# Altium project Gateway.PRJPCB
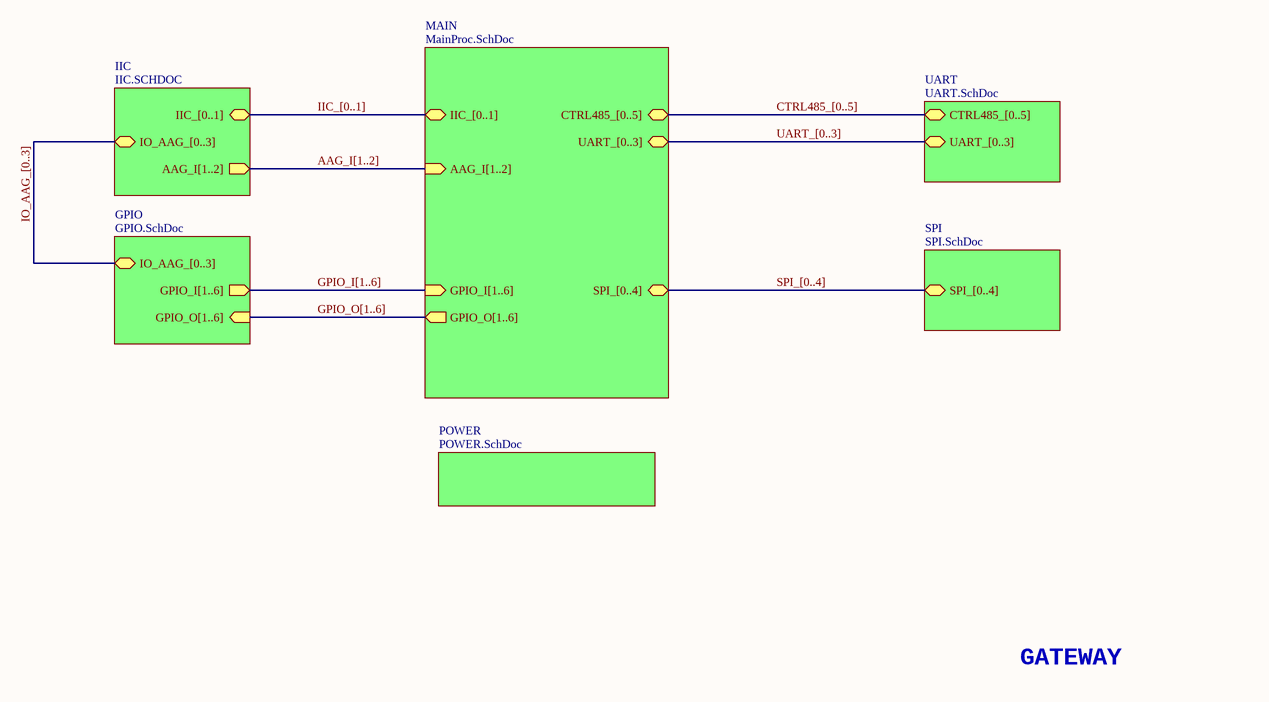
[diagram p0: Gateway.SCHDOC]
7 sheets, 140 parts. Net scope: hierarchical (ports join the sheet entries above them; power ports are global).
Board file: Gateway.PcbDoc
Sheets:
  Gateway.SCHDOC
    MAIN = MainProc.SCHDOC
    SPI = SPI.SCHDOC
    UART = UART.SCHDOC
    POWER = Power.SCHDOC
    GPIO = GPIO.SchDoc
    IIC = IIC.SchDoc

## Sheet Gateway.SCHDOC
size A4; SheetNumber: 1

### Sub-sheets
GPIO = GPIO.SchDoc: GPIO_O[1..6] (in), GPIO_I[1..6] (out), IO_AAG_[0..3] (bidir)
IIC = IIC.SCHDOC: IIC_[0..1] (bidir), IO_AAG_[0..3] (bidir), AAG_I[1..2] (out)
MAIN = MainProc.SchDoc: SPI_[0..4] (bidir), UART_[0..3] (bidir), CTRL485_[0..5] (bidir), GPIO_I[1..6] (in), GPIO_O[1..6] (out), IIC_[0..1] (bidir), AAG_I[1..2] (in)
POWER = POWER.SchDoc: no entries
SPI = SPI.SchDoc: SPI_[0..4] (bidir)
UART = UART.SchDoc: UART_[0..3] (bidir), CTRL485_[0..5] (bidir)

### Buses and harness runs
bus AAG_I[1..2] = sheet IIC/AAG_I[1..2] = sheet MAIN/AAG_I[1..2]
bus CTRL485_[0..5] = sheet MAIN/CTRL485_[0..5] = sheet UART/CTRL485_[0..5]
bus GPIO_I[1..6] = sheet GPIO/GPIO_I[1..6] = sheet MAIN/GPIO_I[1..6]
bus GPIO_O[1..6] = sheet GPIO/GPIO_O[1..6] = sheet MAIN/GPIO_O[1..6]
bus IIC_[0..1] = sheet IIC/IIC_[0..1] = sheet MAIN/IIC_[0..1]
bus IO_AAG_[0..3] = sheet GPIO/IO_AAG_[0..3] = sheet IIC/IO_AAG_[0..3]
bus SPI_[0..4] = sheet MAIN/SPI_[0..4] = sheet SPI/SPI_[0..4]
bus UART_[0..3] = sheet MAIN/UART_[0..3] = sheet UART/UART_[0..3]

### Notes on the sheet
- GATEWAY

## Sheet MainProc.SCHDOC
size B; SheetNumber: 2
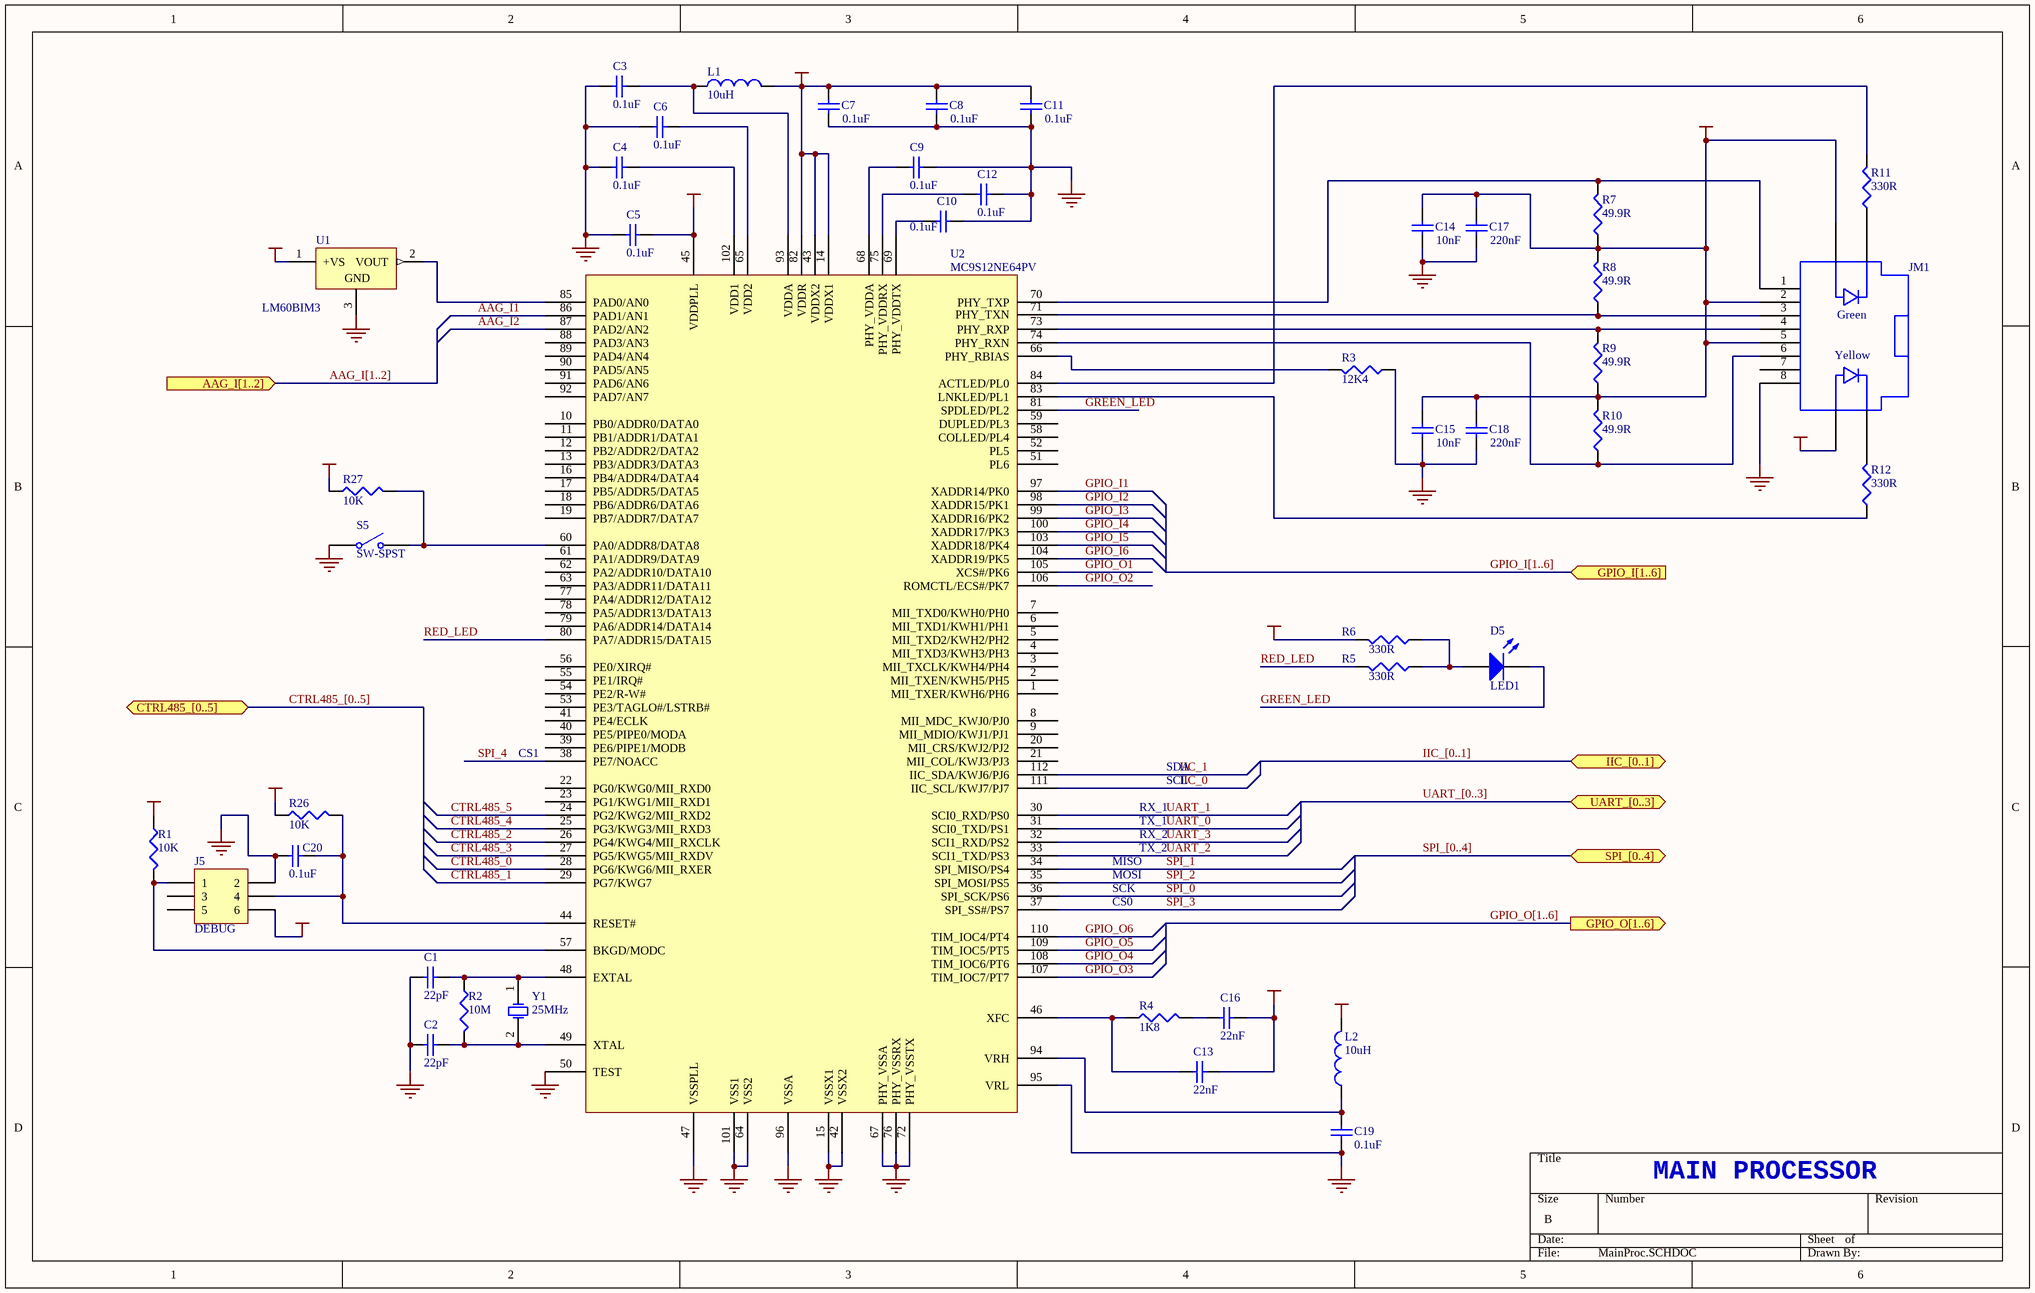
[diagram p1: MainProc.SCHDOC]

### Parts
C1  value 22pF  [_1206]  (hidden comment: Cap Semi)
C2  value 22pF  [_1206]  (hidden comment: Cap Semi)
C3  value 0.1uF  [_0805]  (hidden comment: Cap Semi)
C4  value 0.1uF  [_0805]  (hidden comment: Cap Semi)
C5  value 0.1uF  [_0805]  (hidden comment: Cap Semi)
C6  value 0.1uF  [_0805]  (hidden comment: Cap Semi)
C7  value 0.1uF  [_0805]  (hidden comment: Cap Semi)
C8  value 0.1uF  [_0805]  (hidden comment: Cap Semi)
C9  value 0.1uF  [_0805]  (hidden comment: Cap Semi)
C10  value 0.1uF  [_0805]  (hidden comment: Cap Semi)
C11  value 0.1uF  [_0805]  (hidden comment: Cap Semi)
C12  value 0.1uF  [_0805]  (hidden comment: Cap Semi)
C13  value 22nF  [_0805]  (hidden comment: Cap Semi)
C14  value 10nF  [_0805]  (hidden comment: Cap Semi)
C15  value 10nF  [_0805]  (hidden comment: Cap Semi)
C16  value 22nF  [_0805]  (hidden comment: Cap Semi)
C17  value 220nF  [_0805]  (hidden comment: Cap Semi)
C18  value 220nF  [_0805]  (hidden comment: Cap Semi)
C19  value 0.1uF  [_0805]  (hidden comment: Cap Semi)
C20  value 0.1uF  [_0805]  (hidden comment: Cap Semi)
D5  LED1  [LED_PCB]
J5  DEBUG  [HDR2X3]
JM1  JACK_RJ45_LED  [JACK_RJ45_LEDS]  (value not drawn)
L1  value 10uH  [_0805]  (hidden comment: Inductor)
L2  value 10uH  [_0805]  (hidden comment: Inductor)
R1  value 10K  [_0805]  (hidden comment: Res3)
R2  value 10M  [_1206]  (hidden comment: Res3)
R3  value 12K4  [_0805]  (hidden comment: Res3)
R4  value 1K8  [_0805]  (hidden comment: Res3)
R5  value 330R  [_0805]  (hidden comment: Res3)
R6  value 330R  [_0805]  (hidden comment: Res3)
R7  value 49.9R  [_0805]  (hidden comment: Res3)
R8  value 49.9R  [_0805]  (hidden comment: Res3)
R9  value 49.9R  [_0805]  (hidden comment: Res3)
R10  value 49.9R  [_0805]  (hidden comment: Res3)
R11  value 330R  [_0805]  (hidden comment: Res3)
R12  value 330R  [_0805]  (hidden comment: Res3)
R26  value 10K  [_0805]  (hidden comment: Res3)
R27  value 10K  [_0805]  (hidden comment: Res3)
S5  SW-SPST  [SWITCH]
U1  LM60BIM3  [MA03B]
U2  MC9S12NE64PV  [QFP20x20-G112/Y1.6N]
Y1  value 25MHz  [HC49/4H_SMX]  (hidden comment: XTAL)

### Ports
AAG_I[1..2] (in), CTRL485_[0..5] (bidir), GPIO_I[1..6] (in), GPIO_O[1..6] (out), IIC_[0..1] (bidir), SPI_[0..4] (bidir), UART_[0..3] (bidir)

### Nets
GND: C1.2 C2.2 C3.1 C4.2 C5.2 C6.2 C7.1 C8.1 C9.1 C10.1 C11.1 C12.1 C14.1 C15.1 C17.1 C18.1 C19.1 C20.1 J5.2 JM1.8 R3.1 S5.1(COMMON) U1.3(GND) U2.15(VSSX1) U2.42(VSSX2) U2.47(VSSPLL) U2.50(TEST) U2.64(VSS2) U2.67(PHY_VSSA) U2.72(PHY_VSSTX) U2.76(PHY_VSSRX) U2.95(VRL) U2.96(VSSA) U2.101(VSS1)
VCC_3V: C7.2 C8.2 C11.2 C14.2 C15.2 C17.2 C18.2 J5.6 JM1.2 JM1.5 JM1.GA JM1.YA L1.2 L2.2 R1.1 R6.2 R7.1 R8.2 R9.1 R10.2 R26.1 R27.1 U1.1(+VS) U2.14(VDDX1) U2.43(VDDX2) U2.82(VDDR)
VDD_PLL: C5.1 C13.1 C16.1 U2.45(VDDPLL)
AAG_I1: U2.86(PAD1/AN1)
AAG_I2: U2.87(PAD2/AN2)
CTRL485_0: U2.28(PG6/KWG6/MII_RXER)
CTRL485_1: U2.29(PG7/KWG7)
CTRL485_2: U2.26(PG4/KWG4/MII_RXCLK)
CTRL485_3: U2.27(PG5/KWG5/MII_RXDV)
CTRL485_4: U2.25(PG3/KWG3/MII_RXD3)
CTRL485_5: U2.24(PG2/KWG2/MII_RXD2)
GPIO_I1: U2.97(XADDR14/PK0)
GPIO_I2: U2.98(XADDR15/PK1)
GPIO_I3: U2.99(XADDR16/PK2)
GPIO_I4: U2.100(XADDR17/PK3)
GPIO_I5: U2.103(XADDR18/PK4)
GPIO_I6: U2.104(XADDR19/PK5)
GPIO_O1: U2.105(XCS#/PK6)
GPIO_O2: U2.106(ROMCTL/ECS#/PK7)
GPIO_O3: U2.107(TIM_IOC7/PT7)
GPIO_O4: U2.108(TIM_IOC6/PT6)
GPIO_O5: U2.109(TIM_IOC5/PT5)
GPIO_O6: U2.110(TIM_IOC4/PT4)
GREEN_LED: D5.2(K) U2.81(SPDLED/PL2)
IIC_0: U2.111(IIC_SCL/KWJ7/PJ7)
IIC_1: U2.112(IIC_SDA/KWJ6/PJ6)
RED_LED: R5.2 U2.80(PA7/ADDR15/DATA15)
SPI_0: U2.36(SPI_SCK/PS6)
SPI_1: U2.34(SPI_MISO/PS4)
SPI_2: U2.35(SPI_MOSI/PS5)
SPI_3: U2.37(SPI_SS#/PS7)
SPI_4: U2.38(PE7/NOACC)
UART_0: U2.31(SCI0_TXD/PS1)
UART_1: U2.30(SCI0_RXD/PS0)
UART_2: U2.33(SCI1_TXD/PS3)
UART_3: U2.32(SCI1_RXD/PS2)
NetC1_1: C1.1 R2.1 U2.48(EXTAL) Y1.1(OSC1)
NetC2_1: C2.1 R2.2 U2.49(XTAL) Y1.2(OSC2)
NetC3_2: C3.2 L1.1 U2.93(VDDA)
NetC4_1: C4.1 U2.102(VDD1)
NetC6_1: C6.1 U2.65(VDD2)
NetC9_2: C9.2 U2.68(PHY_VDDA)
NetC10_2: C10.2 U2.69(PHY_VDDTX)
NetC12_2: C12.2 U2.75(PHY_VDDRX)
NetC13_2: C13.2 R4.1 U2.46(XFC)
NetC16_2: C16.2 R4.2
NetC19_2: C19.2 L2.1 U2.94(VRH)
NetC20_2: C20.2 J5.4 R26.2 U2.44(RESET#)
NetD5_1: D5.1(A) R5.1 R6.1
NetJ5_1: J5.1 R1.2 U2.57(BKGD/MODC)
NetJM1_1: JM1.1 R7.2 U2.70(PHY_TXP)
NetJM1_3: JM1.3 R8.1 U2.71(PHY_TXN)
NetJM1_4: JM1.4 R9.2 U2.73(PHY_RXP)
NetJM1_6: JM1.6 R10.1 U2.74(PHY_RXN)
NetJM1_GK: JM1.GK R11.1
NetJM1_YK: JM1.YK R12.2
NetR3_2: R3.2 U2.66(PHY_RBIAS)
NetR11_2: R11.2 U2.84(ACTLED/PL0)
NetR12_1: R12.1 U2.83(LNKLED/PL1)
NetR27_2: R27.2 S5.2(NO) U2.60(PA0/ADDR8/DATA8)
NetU1_2: U1.2(VOUT) U2.85(PAD0/AN0)

Not connected (* = marked no-connect by the designer): J5 3 5; JM1 7; U2 1(MII_TXER/KWH6/PH6) 2(MII_TXEN/KWH5/PH5) 3(MII_TXCLK/KWH4/PH4) 4(MII_TXD3/KWH3/PH3) 5(MII_TXD2/KWH2/PH2) 6(MII_TXD1/KWH1/PH1) 7(MII_TXD0/KWH0/PH0) 8(MII_MDC_KWJ0/PJ0) 9(MII_MDIO/KWJ1/PJ1) 10(PB0/ADDR0/DATA0) 11(PB1/ADDR1/DATA1) 12(PB2/ADDR2/DATA2) 13(PB3/ADDR3/DATA3) 16(PB4/ADDR4/DATA4) 17(PB5/ADDR5/DATA5) 18(PB6/ADDR6/DATA6) 19(PB7/ADDR7/DATA7) 20(MII_CRS/KWJ2/PJ2) 21(MII_COL/KWJ3/PJ3) 22(PG0/KWG0/MII_RXD0) 23(PG1/KWG1/MII_RXD1) 39(PE6/PIPE1/MODB) 40(PE5/PIPE0/MODA) 41(PE4/ECLK) 51(PL6) 52(PL5) 53(PE3/TAGLO#/LSTRB#) 54(PE2/R-W#) 55(PE1/IRQ#) 56(PE0/XIRQ#) 58(COLLED/PL4) 59(DUPLED/PL3) 61(PA1/ADDR9/DATA9) 62(PA2/ADDR10/DATA10) 63(PA3/ADDR11/DATA11) 77(PA4/ADDR12/DATA12) 78(PA5/ADDR13/DATA13) 79(PA6/ADDR14/DATA14) 88(PAD3/AN3) 89(PAD4/AN4) 90(PAD5/AN5) 91(PAD6/AN6) 92(PAD7/AN7)

### Buses and harness runs
bus AAG_I[1..2] = port AAG_I[1..2]
bus CTRL485_[0..5] = port CTRL485_[0..5]
bus GPIO_I[1..6] = port GPIO_I[1..6]
bus GPIO_O[1..6] = port GPIO_O[1..6]
bus IIC_[0..1] = port IIC_[0..1]
bus SPI_[0..4] = port SPI_[0..4]
bus UART_[0..3] = port UART_[0..3]

### Notes on the sheet
- (near U2) CS1
- SDA
- RX_2
- TX_1
- RX_1
- SCL
- SCK
- MISO
- MOSI
- CS0
- TX_2
- MAIN PROCESSOR
- (in symbol JACK_RJ45_LED) Green; Yellow

### Library data of the parts
C1-C20 = Cap Semi: Capacitor (Semiconductor SIM Model); Published: 8-Jun-2000; Revision: July-2002: Re-released for DXP Platform.; Publisher: Altium Limited
D5 = LED1: Typical RED GaAs LED; Published: 8-Jun-2000; Revision: July-2002: Re-released for DXP Platform.; Publisher: Altium Limited
J5 = Header 3X2: Header, 3-Pin, Dual row; Revision: 17-Jul-2002: Re-released for DXP Platform.; Publisher: Altium Limited
JM1 = JACK_RJ45_LED: RJ45 Connector Jack with Leds
R1-R12 R26 R27 = Res3: Resistor; Published: 8-Jun-2000; Revision: July-2002: Re-released for DXP Platform.; Publisher: Altium Limited
S5 = SW-SPST: Single-Pole, Single-Throw Switch; Published: 24-Mar-1999; Revision: July-2002: Re-released for DXP Platform.; Publisher: Altium Limited
U1 = LM60BIM3: 2.7V, SOT-23 Temperature Sensor; Package Information: Latest Revision: 2000; Published: 15-Apr-2002; Datasheet: Latest Revision: May-1998; Package Reference: MA03B; Publisher: Altium Limited
U2 = MC9S12NE64PV: Integrated Ethernet Controller
Y1 = XTAL: Crystal Oscillator; Published: 8-Jun-2000; Revision: July-2002: Re-released for DXP Platform.; Publisher: Altium Limited
L1 L2 = Inductor: Published: 8-Jun-2000; Revision: July-2002: Re-released for DXP Platform.; Publisher: Altium Limited

## Sheet SPI.SCHDOC
size A4; SheetNumber: 6
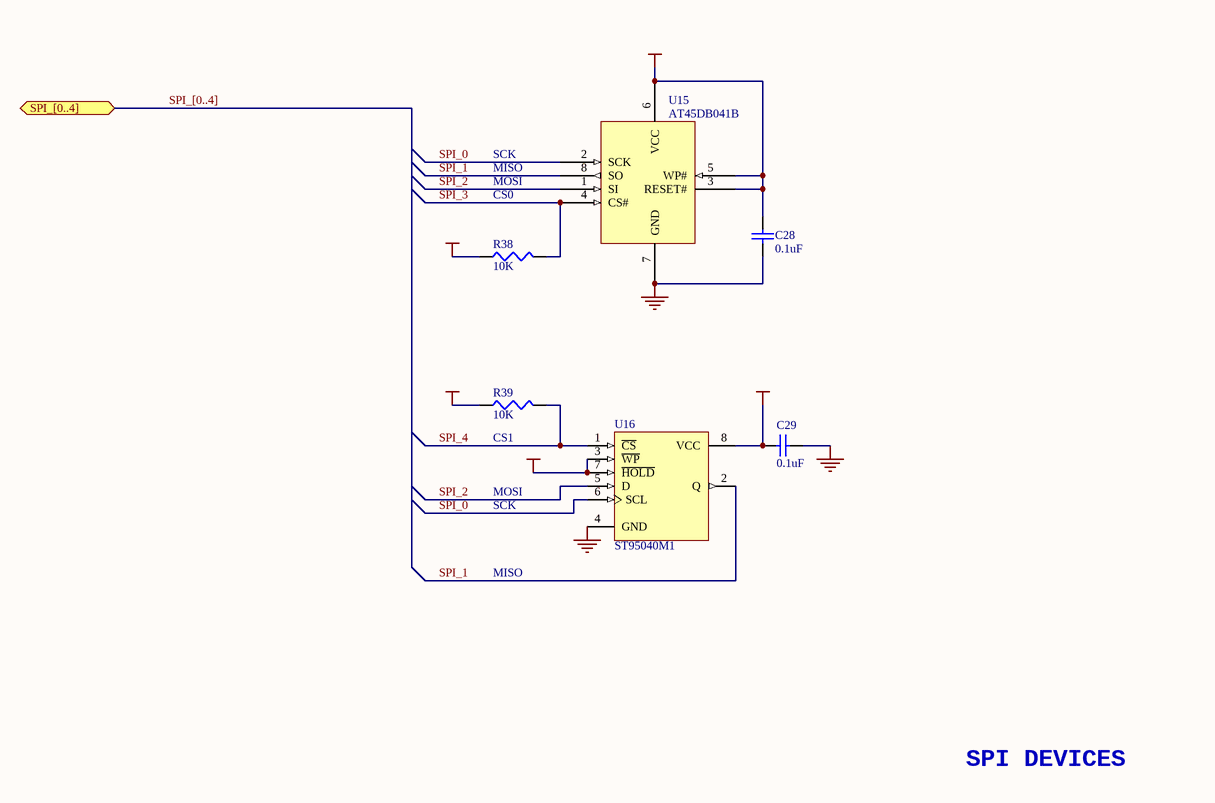
[diagram p2: SPI.SCHDOC]

### Parts
C28  value 0.1uF  [_0805]  (hidden comment: Cap Semi)
C29  value 0.1uF  [_0805]  (hidden comment: Cap Semi)
R38  value 10K  [_0805]  (hidden comment: Res3)
R39  value 10K  [_0805]  (hidden comment: Res3)
U15  AT45DB041B  [SO-G8/E4.1]
U16  ST95040M1  [SOP8]

### Ports
SPI_[0..4] (bidir)

### Nets
GND: C28.2 C29.2 U15.7(GND) U16.4(GND)
VCC_3V: C28.1 C29.1 R38.1 R39.1 U15.3(RESET#) U15.5(WP#) U15.6(VCC) U16.3(~{WP}) U16.7(~{HOLD}) U16.8(VCC)
SPI_0: U15.2(SCK) U16.6(SCL)
SPI_1: U15.8(SO) U16.2(Q)
SPI_2: U15.1(SI) U16.5(D)
SPI_3: R38.2 U15.4(CS#)
SPI_4: R39.2 U16.1(~{CS})

### Buses and harness runs
bus SPI_[0..4] = port SPI_[0..4]

### Notes on the sheet
- SCK
- MISO
- MOSI
- CS0
- (near R39) CS1
- SPI DEVICES

### Library data of the parts
C28 C29 = Cap Semi: Capacitor (Semiconductor SIM Model); Published: 8-Jun-2000; Revision: July-2002: Re-released for DXP Platform.; Publisher: Altium Limited
R38 R39 = Res3: Resistor; Published: 8-Jun-2000; Revision: July-2002: Re-released for DXP Platform.; Publisher: Altium Limited
U15 = AT45DB041B: 4 Megabit DataFlash Memory
U16 = ST95040M1: 4K Serial SPI EEPROM with Positive Clock Strobe; Package Information: Latest Revision: Jul-1999; Published: 24-Aug-2001; Revision: 17-Jul-2002: Re-released for DXP Platform.; Datasheet: Latest Revision: Jun-1998; Package Reference: SOP8; Publisher: Altium Limited

## Sheet UART.SCHDOC
size A4; SheetNumber: 4
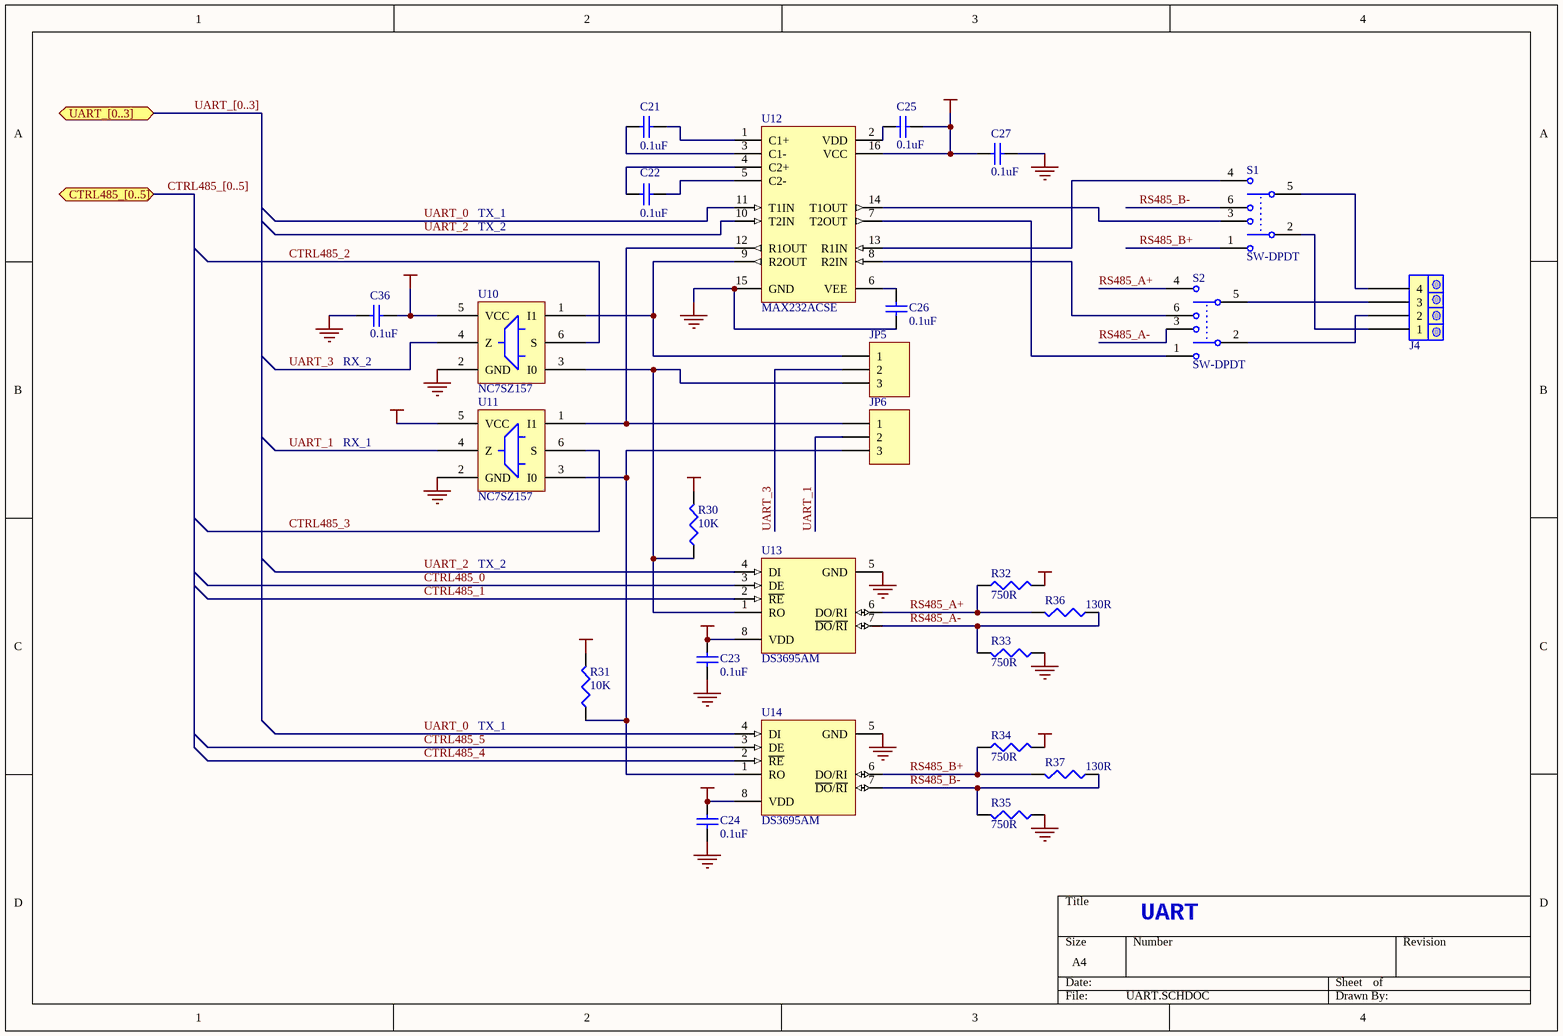
[diagram p3: UART.SCHDOC]

### Parts
C21  value 0.1uF  [_0805]  (hidden comment: Cap Semi)
C22  value 0.1uF  [_0805]  (hidden comment: Cap Semi)
C23  value 0.1uF  [_0805]  (hidden comment: Cap Semi)
C24  value 0.1uF  [_0805]  (hidden comment: Cap Semi)
C25  value 0.1uF  [_0805]  (hidden comment: Cap Semi)
C26  value 0.1uF  [_0805]  (hidden comment: Cap Semi)
C27  value 0.1uF  [_0805]  (hidden comment: Cap Semi)
C36  value 0.1uF  [_0805]  (hidden comment: Cap Semi)
J4  BORNERA_X4  [BORNERA_X4]  (value not drawn)
JP5  Header 3  [HDR1X3]  (value not drawn)
JP6  Header 3  [HDR1X3]  (value not drawn)
R30  value 10K  [_0805]  (hidden comment: Res3)
R31  value 10K  [_0805]  (hidden comment: Res3)
R32  value 750R  [_1206]  (hidden comment: Res3)
R33  value 750R  [_1206]  (hidden comment: Res3)
R34  value 750R  [_1206]  (hidden comment: Res3)
R35  value 750R  [_1206]  (hidden comment: Res3)
R36  value 130R  [_1206]  (hidden comment: Res3)
R37  value 130R  [_1206]  (hidden comment: Res3)
S1  SW-DPDT  [Switch_EG2207]
S2  SW-DPDT  [Switch_EG2207]
U10  NC7SZ157  [SO-G6/Z2.8]
U11  NC7SZ157  [SO-G6/Z2.8]
U12  MAX232ACSE  [NSO16]
U13  DS3695AM  [M08A]
U14  DS3695AM  [M08A]

### Ports
CTRL485_[0..5] (bidir), UART_[0..3] (bidir)

### Nets
GND: C23.2 C24.2 C26.2 C27.2 C36.1 R33.1 R35.1 U10.2(GND) U11.2(GND) U12.15(GND) U13.5(GND) U14.5(GND)
VCC_3V: C36.2 U10.5(VCC) U11.5(VCC)
VCC_5V: C23.1 C24.1 C25.1 C27.1 R30.2 R31.2 R32.2 R34.2 U12.16(VCC) U13.8(VDD) U14.8(VDD)
CTRL485_0: U13.3(DE)
CTRL485_1: U13.2(~{RE})
CTRL485_2: U10.6(S)
CTRL485_3: U11.6(S)
CTRL485_4: U14.2(~{RE})
CTRL485_5: U14.3(DE)
RS485_A+: R32.1 R36.2 S2.4 U13.6(DO/RI)
RS485_A-: R33.2 R36.1 S2.3 U13.7(~{DO}/~{RI})
RS485_B+: R34.1 R37.2 S1.1 U14.6(DO/RI)
RS485_B-: R35.2 R37.1 S1.6 U14.7(~{DO}/~{RI})
UART_0: U12.11(T1IN) U14.4(DI)
UART_1: JP6.2 U11.4(Z)
UART_2: U12.10(T2IN) U13.4(DI)
UART_3: JP5.2 U10.4(Z)
NetC21_1: C21.1 U12.3(C1-)
NetC21_2: C21.2 U12.1(C1+)
NetC22_1: C22.1 U12.4(C2+)
NetC22_2: C22.2 U12.5(C2-)
NetC25_2: C25.2 U12.2(VDD)
NetC26_1: C26.1 U12.6(VEE)
NetJ4_1: J4.1 S1.2
NetJ4_2: J4.2 S2.2
NetJ4_3: J4.3 S2.5
NetJ4_4: J4.4 S1.5
NetJP5_1: JP5.1 U10.1(I1) U12.9(R2OUT)
NetJP5_3: JP5.3 R30.1 U10.3(I0) U13.1(RO)
NetJP6_1: JP6.1 U11.1(I1) U12.12(R1OUT)
NetJP6_3: JP6.3 R31.1 U11.3(I0) U14.1(RO)
NetS1_3: S1.3 U12.14(T1OUT)
NetS1_4: S1.4 U12.13(R1IN)
NetS2_1: S2.1 U12.7(T2OUT)
NetS2_6: S2.6 U12.8(R2IN)

### Buses and harness runs
bus CTRL485_[0..5] = port CTRL485_[0..5]
bus UART_[0..3] = port UART_[0..3]

### Notes on the sheet
- TX_1
- TX_2
- (near C36) RX_2
- RX_1
- UART

### Library data of the parts
C21-C27 C36 = Cap Semi: Capacitor (Semiconductor SIM Model); Published: 8-Jun-2000; Revision: July-2002: Re-released for DXP Platform.; Publisher: Altium Limited
JP5 JP6 = Header 3: Header, 3-Pin; Revision: 17-Jul-2002: Re-released for DXP Platform.; Publisher: Altium Limited
R30-R37 = Res3: Resistor; Published: 8-Jun-2000; Revision: July-2002: Re-released for DXP Platform.; Publisher: Altium Limited
S1 S2 = SW-DPDT: Double-Pole, Double-Throw Switch; Published: 24-Mar-1999; Revision: July-2002: Re-released for DXP Platform.; Publisher: Altium Limited
U10 U11 = NC7SZ157: Tiny Logic 2-Input Non-Inverter Mux
U12 = MAX232ACSE: +5V Powered, Multi-Channel RS-232 Driver/Receiver; Code - JEDEC: MS-012-AC; Code - IPC: SO16; Published: 16-Jan-2001; Revision: 17-Jul-2002: Re-released for DXP Platform.; Package Reference: NSO16; Publisher: Altium Limited
U13 U14 = DS3695AM: Multipoint RS485/RS422 Transceiver; Package Information: Latest Revision: Sep-1997; Code - JEDEC: MS-012-AA; Code - IPC: SO8; Published: 15-Apr-2002; Datasheet: Latest Revision: Feb-1996; Package Reference: M08A; Publisher: Altium Limited

## Sheet Power.SCHDOC
size A4; SheetNumber: 3
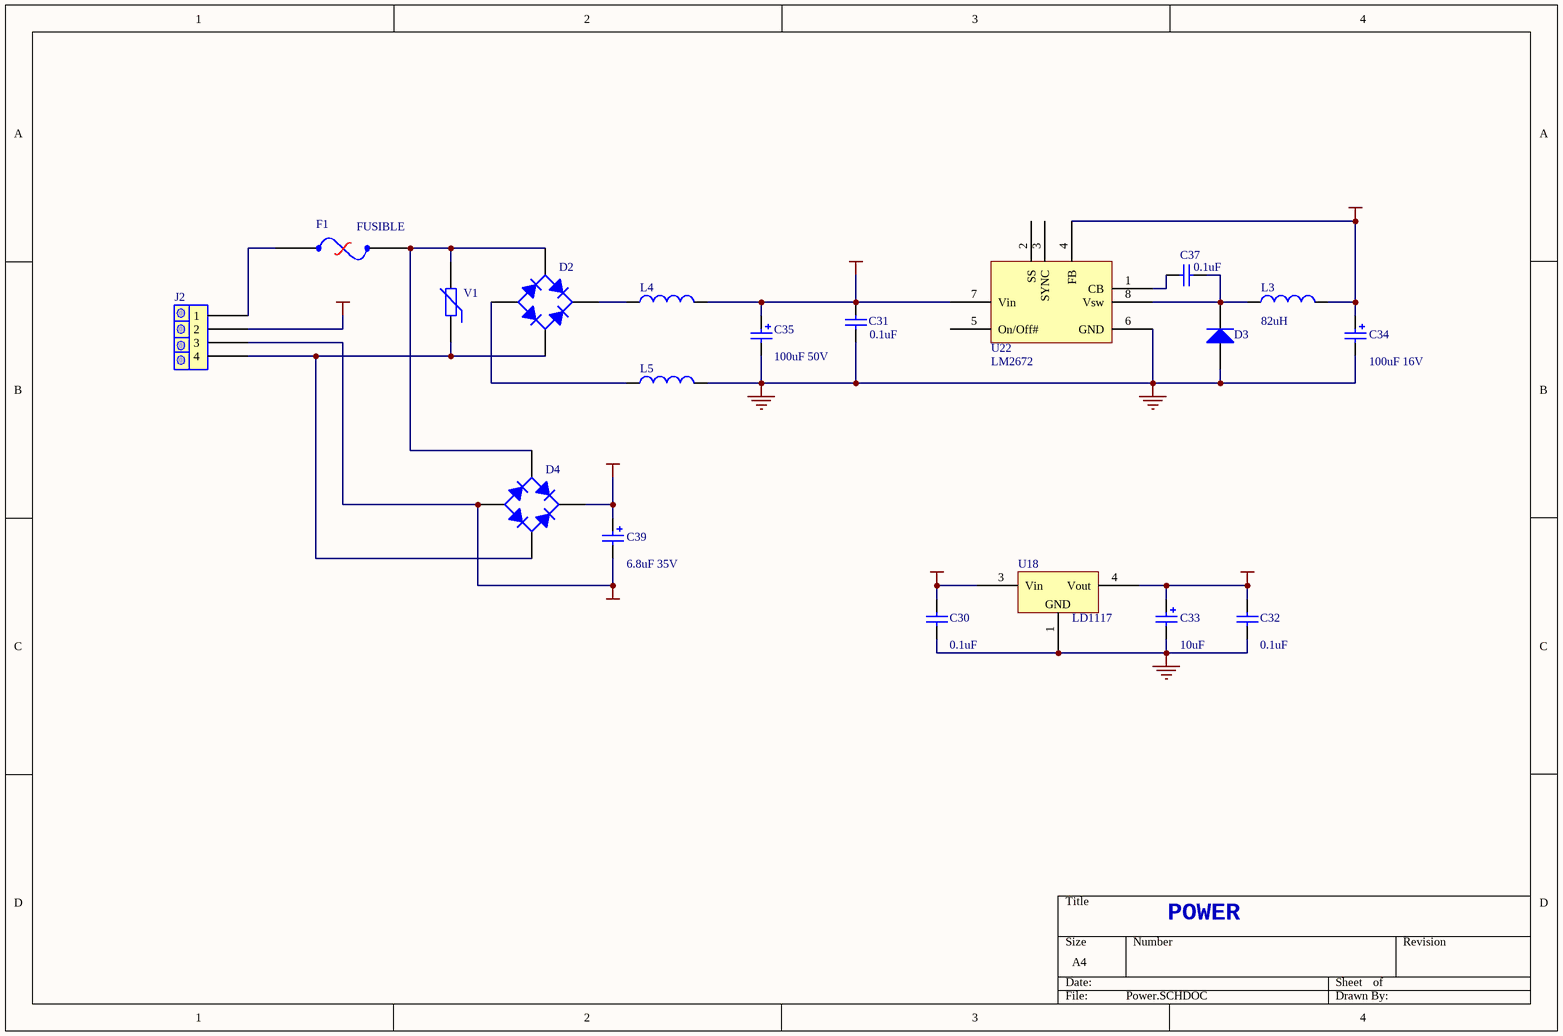
[diagram p4: Power.SCHDOC]

### Parts
C30  value 0.1uF  [_0805]  (hidden comment: Cap Semi)
C31  value 0.1uF  [_0805]  (hidden comment: Cap Semi)
C32  value 0.1uF  [_0805]  (hidden comment: Cap Semi)
C33  value 10uF  [TC3528-1411]  (hidden comment: Cap Pol3)
C34  value 100uF 16V  [TC7360-2924]  (hidden comment: Cap Pol3)
C35  value 100uF 50V  [CAPPR3.5-8X11.5]  (hidden comment: Cap Pol1)
C37  value 0.1uF  [_0805]  (hidden comment: Cap Semi)
C39  value 6.8uF 35V  [TC6032-2412]  (hidden comment: Cap Pol3)
D2  Bridge1  [BRIDGE_2A]  (value not drawn)
D3  Diode  [SMA]  (value not drawn)
D4  Bridge1  [BRIDGE_2A]  (value not drawn)
F1  FUSIBLE  [FUSE]
J2  BORNERA_X4  [BORNERA_X4]  (value not drawn)
L3  value 82uH  [POWER_IND]  (hidden comment: Inductor)
L4  Inductor  [CR3225-1210]  (value not drawn)
L5  Inductor  [CR3225-1210]  (value not drawn)
U18  LD1117  [SIP-G3/D11.3]
U22  LM2672  [SO-G8/D5]
V1  Res Varistor  [CR3216-1206]  (value not drawn)

### Nets
GND: C30.1 C31.1 C32.1 C33.2 C34.2 C35.2 D3.1(A) L5.2 U18.1(GND) U22.6(GND)
GND_PWR: C39.2 D4.1(A) J2.3
VCC_3V: C32.2 C33.1 U18.4(Vout)
VCC_5V: C30.2 C34.1 L3.2 U18.3(Vin) U22.4(FB)
VCC_IN: C31.2 C35.1 L4.2 U22.7(Vin)
VCC_PWR: C39.1 D4.3(K) J2.2
NetC37_1: C37.1 D3.2(K) L3.1 U22.8(Vsw)
NetC37_2: C37.2 U22.1(CB)
NetD2_1: D2.1(A) L5.1
NetD2_2: D2.2(C) D4.2(C) F1.2 V1.2
NetD2_3: D2.3(K) L4.1
NetD2_4: D2.4(C) D4.4(C) J2.4 V1.1
NetF1_1: F1.1 J2.1

Not connected (* = marked no-connect by the designer): U22 2(SS) 3(SYNC) 5(On/Off#)

### Notes on the sheet
- POWER

### Library data of the parts
C30-C32 C37 = Cap Semi: Capacitor (Semiconductor SIM Model); Published: 8-Jun-2000; Revision: July-2002: Re-released for DXP Platform.; Publisher: Altium Limited
C33 C34 C39 = Cap Pol3: Polarized Capacitor (Surface Mount); Published: 8-Jun-2000; Revision: July-2002: Re-released for DXP Platform.; Publisher: Altium Limited
C35 = Cap Pol1: Polarized Capacitor (Radial); Published: 8-Jun-2000; Revision: July-2002: Re-released for DXP Platform.; Publisher: Altium Limited
D2 D4 = Bridge1: Full Wave Diode Bridge; Published: 8-Jun-2000; Revision: July-2002: Re-released for DXP Platform.; Publisher: Altium Limited
D3 = Diode: Default Diode; Code - JEDEC: DO-214-AB; Published: 8-Jun-2000; Revision: July-2002: Re-released for DXP Platform.; Publisher: Altium Limited
F1 = FUSIBLE: Resetteable Fuse
L4 L5 = Inductor: Value: 10mH; Published: 8-Jun-2000; Revision: July-2002: Re-released for DXP Platform.; Publisher: Altium Limited
U18 = VREG_3V3_DPAK: SMD DPAK Voltage Regulator
U22 = LM2672: Simple switcher voltage regulator 1A
V1 = Res Varistor: Varistor (Voltage-Sensitive Resistor); Published: 24-Mar-1999; Revision: July-2002: Re-released for DXP Platform.; Publisher: Altium Limited
L3 = Inductor: Published: 8-Jun-2000; Revision: July-2002: Re-released for DXP Platform.; Publisher: Altium Limited

## Sheet GPIO.SchDoc
size A4; SheetNumber: 5
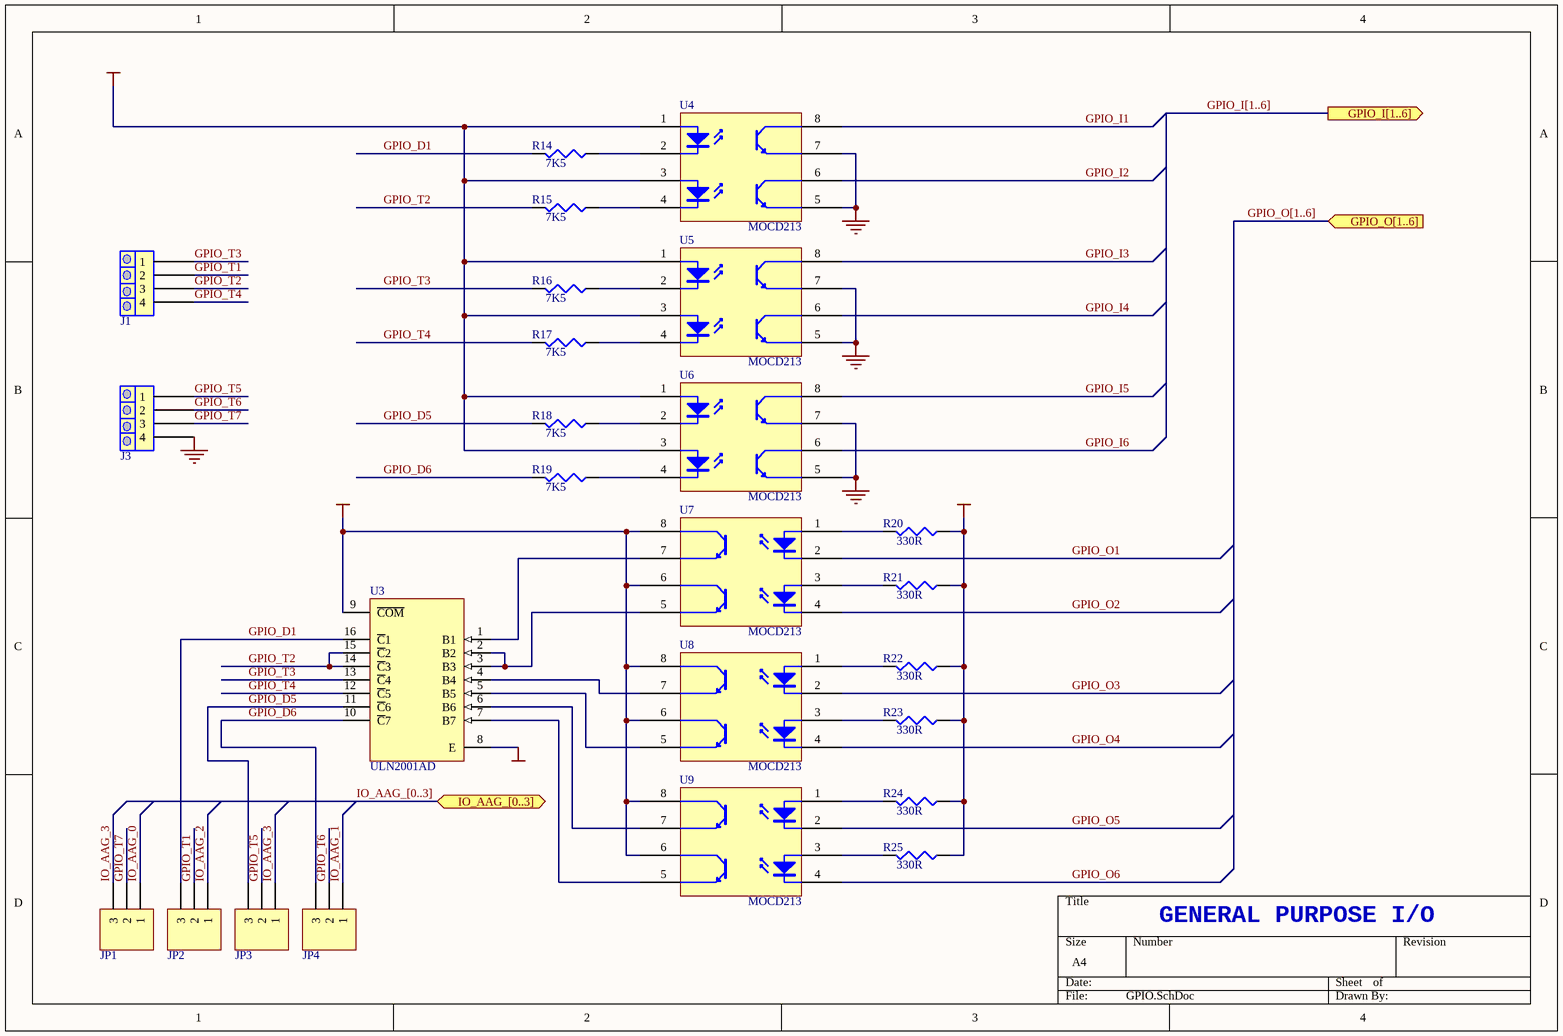
[diagram p5: GPIO.SchDoc]

### Parts
J1  BORNERA_X4  [BORNERA_X4]  (value not drawn)
J3  BORNERA_X4  [BORNERA_X4]  (value not drawn)
JP1  Header 3  [HDR1X3]  (value not drawn)
JP2  Header 3  [HDR1X3]  (value not drawn)
JP3  Header 3  [HDR1X3]  (value not drawn)
JP4  Header 3  [HDR1X3]  (value not drawn)
R14  value 7K5  [_0805]  (hidden comment: Res3)
R15  value 7K5  [_0805]  (hidden comment: Res3)
R16  value 7K5  [_0805]  (hidden comment: Res3)
R17  value 7K5  [_0805]  (hidden comment: Res3)
R18  value 7K5  [_0805]  (hidden comment: Res3)
R19  value 7K5  [_0805]  (hidden comment: Res3)
R20  value 330R  [_0805]  (hidden comment: Res3)
R21  value 330R  [_0805]  (hidden comment: Res3)
R22  value 330R  [_0805]  (hidden comment: Res3)
R23  value 330R  [_0805]  (hidden comment: Res3)
R24  value 330R  [_0805]  (hidden comment: Res3)
R25  value 330R  [_0805]  (hidden comment: Res3)
U3  ULN2001AD  [D016]
U4  MOCD213  [SO-G8/D5]
U5  MOCD213  [SO-G8/D5]
U6  MOCD213  [SO-G8/D5]
U7  MOCD213  [SO-G8/D5]
U8  MOCD213  [SO-G8/D5]
U9  MOCD213  [SO-G8/D5]

### Ports
GPIO_I[1..6] (out), GPIO_O[1..6] (in), IO_AAG_[0..3] (bidir)

### Nets
GND: J3.4 U4.5 U4.7 U5.5 U5.7 U6.5 U6.7
GND_PWR: U3.8(E)
VCC_3V: R20.1 R21.1 R22.1 R23.1 R24.1 R25.1
VCC_PWR: U3.9(~{COM}) U4.1 U4.3 U5.1 U5.3 U6.1 U6.3 U7.6 U7.8 U8.6 U8.8 U9.6 U9.8
GPIO_D1: JP2.3 R14.2 U3.16(~{C}1)
GPIO_D5: JP3.3 R18.2 U3.11(~{C}6)
GPIO_D6: JP4.3 R19.2 U3.10(~{C}7)
GPIO_I1: U4.8
GPIO_I2: U4.6
GPIO_I3: U5.8
GPIO_I4: U5.6
GPIO_I5: U6.8
GPIO_I6: U6.6
GPIO_O1: U7.2
GPIO_O2: U7.4
GPIO_O3: U8.2
GPIO_O4: U8.4
GPIO_O5: U9.2
GPIO_O6: U9.4
GPIO_T1: J1.2 JP2.2
GPIO_T2: J1.3 R15.2 U3.14(~{C}3) U3.15(~{C}2)
GPIO_T3: J1.1 R16.2 U3.13(~{C}4)
GPIO_T4: J1.4 R17.2 U3.12(~{C}5)
GPIO_T5: J3.1 JP3.2
GPIO_T6: J3.2 JP4.2
GPIO_T7: J3.3 JP1.2
IO_AAG_0: JP1.1
IO_AAG_1: JP4.1
IO_AAG_2: JP2.1
IO_AAG_3: JP1.3 JP3.1
NetR14_1: R14.1 U4.2
NetR15_1: R15.1 U4.4
NetR16_1: R16.1 U5.2
NetR17_1: R17.1 U5.4
NetR18_1: R18.1 U6.2
NetR19_1: R19.1 U6.4
NetR20_2: R20.2 U7.1
NetR21_2: R21.2 U7.3
NetR22_2: R22.2 U8.1
NetR23_2: R23.2 U8.3
NetR24_2: R24.2 U9.1
NetR25_2: R25.2 U9.3
NetU3_1: U3.1(B1) U7.7
NetU3_2: U3.2(B2) U3.3(B3) U7.5
NetU3_4: U3.4(B4) U8.7
NetU3_5: U3.5(B5) U8.5
NetU3_6: U3.6(B6) U9.7
NetU3_7: U3.7(B7) U9.5

### Buses and harness runs
bus GPIO_I[1..6] = port GPIO_I[1..6]
bus GPIO_O[1..6] = port GPIO_O[1..6]
bus IO_AAG_[0..3] = port IO_AAG_[0..3]

### Notes on the sheet
- GENERAL PURPOSE I/O

### Library data of the parts
JP1-JP4 = Header 3: Header, 3-Pin; Revision: 17-Jul-2002: Re-released for DXP Platform.; Publisher: Altium Limited
R14-R25 = Res3: Resistor; Published: 8-Jun-2000; Revision: July-2002: Re-released for DXP Platform.; Publisher: Altium Limited
U3 = ULN2003AD: Darlington Transistor Array; Package Information: Latest Revision: Jan-1998; Published: 15-May-2002; Datasheet: 1991 Interface Circuits Data Book (Sep-1986); Package Reference: D016; Publisher: Altium Limited
U4-U9 = MOCD213: Dual Channel Phototransistor

## Sheet IIC.SchDoc
size A4; SheetNumber: 7
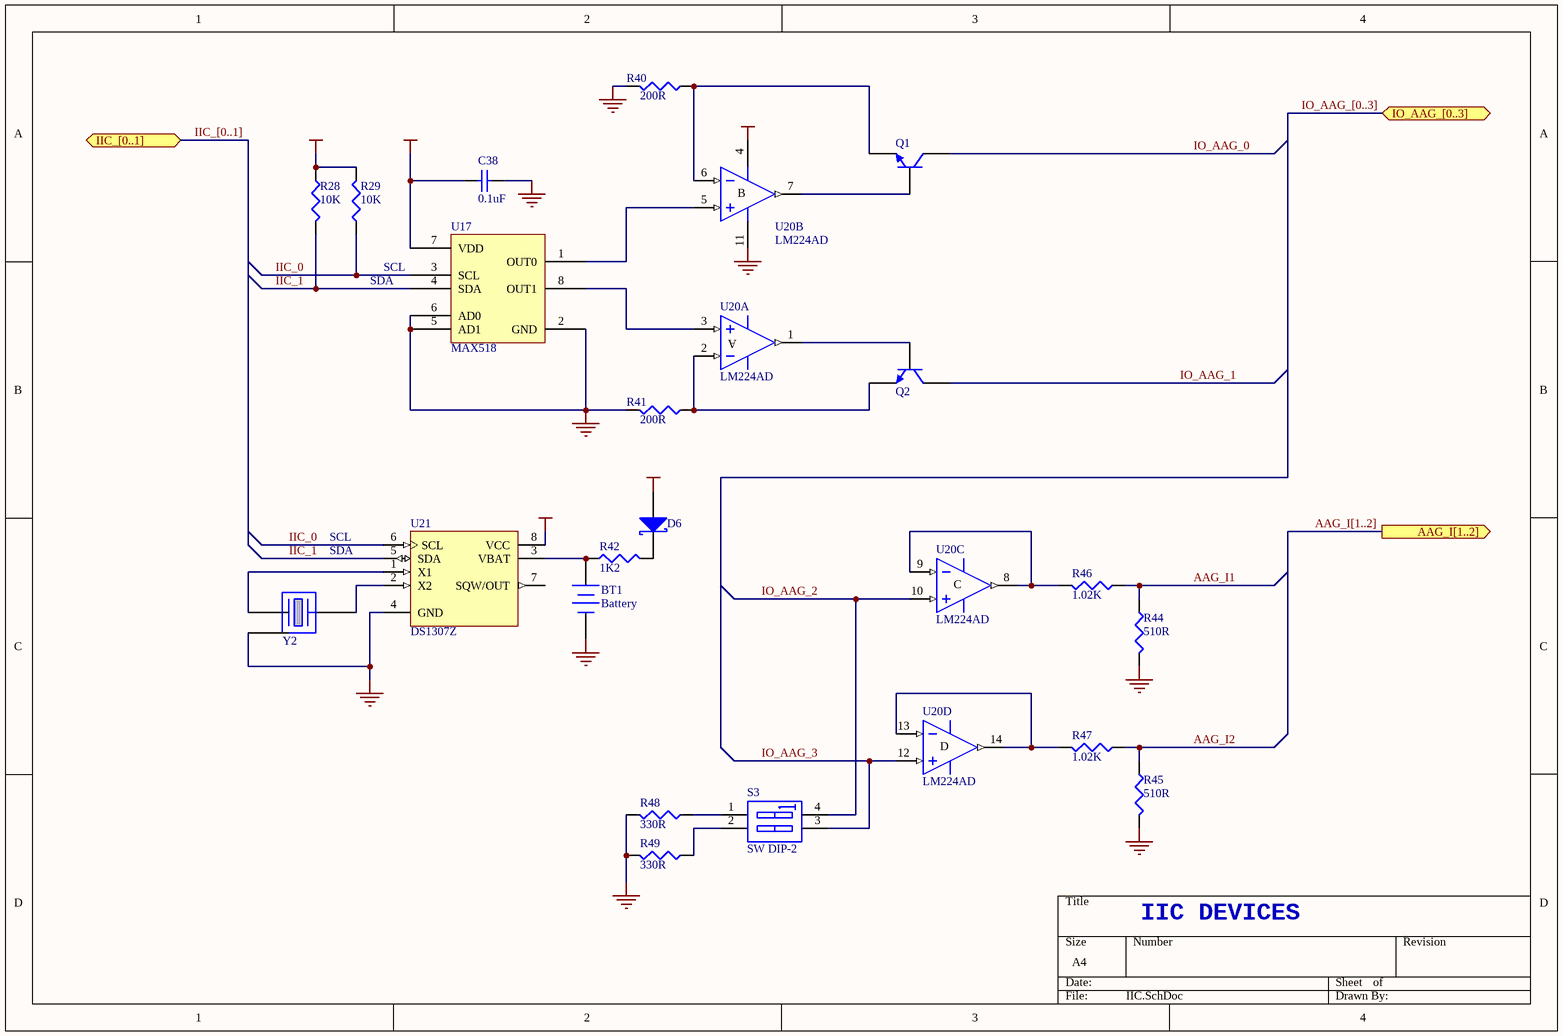
[diagram p6: IIC.SchDoc]

### Parts
BT1  Battery  [LITHIUM_BAT]
C38  value 0.1uF  [_0805]  (hidden comment: Cap Semi)
D6  Diode BAS70  [SO-G3/C2.5]  (value not drawn)
Q1  QNPN  [SO-G3/C2.5]  (value not drawn)
Q2  QNPN  [SO-G3/C2.5]  (value not drawn)
R28  value 10K  [_0805]  (hidden comment: Res3)
R29  value 10K  [_0805]  (hidden comment: Res3)
R40  value 200R  [_1206]  (hidden comment: Res3)
R41  value 200R  [_1206]  (hidden comment: Res3)
R42  value 1K2  [_0805]  (hidden comment: Res3)
R44  value 510R  [_0805]  (hidden comment: Res3)
R45  value 510R  [_0805]  (hidden comment: Res3)
R46  value 1.02K  [_0805]  (hidden comment: Res3)
R47  value 1.02K  [_0805]  (hidden comment: Res3)
R48  value 330R  [_0805]  (hidden comment: Res3)
R49  value 330R  [_0805]  (hidden comment: Res3)
S3  SW DIP-2  [SWITCH_2SPST]
U17  MAX518  [SO-G8/D5]
U20  LM224AD  [SO14B]  (parts A,B,C,D of 4)
U21  DS1307Z  [SOIC8N]
Y2  CRISTAL_SMD  [XTAL_32KHZ]  (value not drawn)

### Ports
AAG_I[1..2] (out), IIC_[0..1] (bidir), IO_AAG_[0..3] (bidir)

### Nets
GND: BT1.2(-) C38.2 R40.2 R41.2 R44.1 R45.1 R48.1 R49.1 U17.2(GND) U17.5(AD1) U17.6(AD0) U20.11(V-) U21.4(GND) Y2.0
VCC_3V: D6.1(A) R28.1 R29.2
VCC_5V: C38.1 U17.7(VDD) U21.8(VCC)
VCC_IN: U20.4(V+)
AAG_I1: R44.2 R46.2
AAG_I2: R45.2 R47.2
IIC_0: R29.1 U17.3(SCL) U21.6(SCL)
IIC_1: R28.2 U17.4(SDA) U21.5(SDA)
IO_AAG_0: Q1.3(C)
IO_AAG_1: Q2.3(C)
IO_AAG_2: S3.4(B1) U20.10(IN+)
IO_AAG_3: S3.3(B2) U20.12(IN+)
NetBT1_1: BT1.1(+) R42.1 U21.3(VBAT)
NetD6_3: D6.3(K) R42.2
NetQ1_1: Q1.1(B) U20.7(OUT)
NetQ1_2: Q1.2(E) R40.1 U20.6(IN-)
NetQ2_1: Q2.1(B) U20.1(OUT)
NetQ2_2: Q2.2(E) R41.1 U20.2(IN-)
NetR46_1: R46.1 U20.8(OUT) U20.9(IN-)
NetR47_1: R47.1 U20.13(IN-) U20.14(OUT)
NetR48_2: R48.2 S3.1(A1)
NetR49_2: R49.2 S3.2(A2)
NetU17_1: U17.1(OUT0) U20.5(IN+)
NetU17_8: U17.8(OUT1) U20.3(IN+)
NetU21_1: U21.1(X1) Y2.2
NetU21_2: U21.2(X2) Y2.1

Not connected (* = marked no-connect by the designer): U21 7(SQW/OUT)

### Buses and harness runs
bus AAG_I[1..2] = port AAG_I[1..2]
bus IIC_[0..1] = port IIC_[0..1]
bus IO_AAG_[0..3] = port IO_AAG_[0..3]

### Notes on the sheet
- SDA
- SCL
- IIC DEVICES
- (in symbol LM324AD, part A) A
- (in symbol LM324AD, part B) B
- (in symbol LM324AD, part C) C
- (in symbol LM324AD, part D) D

### Library data of the parts
BT1 = Battery: Multicell Battery; Published: 24-Mar-1999; Revision: July-2002: Re-released for DXP Platform.; Publisher: Altium Limited
C38 = Cap Semi: Capacitor (Semiconductor SIM Model); Published: 8-Jun-2000; Revision: July-2002: Re-released for DXP Platform.; Publisher: Altium Limited
D6 = Diode BAS70: Silicon AF Schottky Diode for High-Speed Switching; Package Information: Latest Revision: Sep-2001; Note: Pin 2 is not connected and not drawn.; Published: 21-Mar-2003; Datasheet: Latest Revision: Oct-1999; Package Reference: SOT-23; Publisher: Altium Limited
Q1 Q2 = QNPN: NPN Bipolar Transistor; Code - JEDEC: SOT-23; Published: 8-Jun-2000; Revision: July-2002: Re-released for DXP Platform.; Publisher: Altium Limited
R28 R29 R40-R42 R44-R49 = Res3: Resistor; Published: 8-Jun-2000; Revision: July-2002: Re-released for DXP Platform.; Publisher: Altium Limited
S3 = SW DIP-2: DIP Switch; Published: 24-Mar-1999; Revision: July-2002: Re-released for DXP Platform.; Publisher: Altium Limited
U17 = MAX518: 2-Wire serial 8-bit DACs
U20 = LM324AD: Low-Power Quad Operational Amplifier; Package Information: Latest Revision: Sep-1998; Published: 24-Aug-2001; Revision: 17-Jul-2002: Re-released for DXP Platform.; Datasheet: Latest Revision: Nov-1997; Package Reference: SO14B; Publisher: Altium Limited
U21 = DS1307Z: 64 X 8 Serial Real-Time Clock; Package Information: Latest Revision: 1999; Published: 13-Oct-2000; Revision: 17-Jul-2002: Re-released for DXP Platform.; Datasheet: Latest Revision: 10-Aug-1999; Package Reference: SOIC8N; Publisher: Altium Limited

## Nets that join several sheets
GND: MainProc (34 pins), SPI (C28.2 C29.2 U15.7 U16.4), UART (12 pins), Power (10 pins), GPIO (7 pins), IIC (14 pins)
GND_PWR: Power (C39.2 D4.1 J2.3), GPIO (U3.8)
VCC_3V: MainProc (26 pins), SPI (10 pins), UART (C36.2 U10.5 U11.5), Power (C32.2 C33.1 U18.4), GPIO (6 pins), IIC (D6.1 R28.1 R29.2)
VCC_5V: UART (11 pins), Power (5 pins), IIC (C38.1 U17.7 U21.8)
VCC_IN: Power (C31.2 C35.1 L4.2 U22.7), IIC (U20.4)
VCC_PWR: Power (C39.1 D4.3 J2.2), GPIO (13 pins)
AAG_I1: MainProc (U2.86), IIC (R44.2 R46.2)
AAG_I2: MainProc (U2.87), IIC (R45.2 R47.2)
CTRL485_0: MainProc (U2.28), UART (U13.3)
CTRL485_1: MainProc (U2.29), UART (U13.2)
CTRL485_2: MainProc (U2.26), UART (U10.6)
CTRL485_3: MainProc (U2.27), UART (U11.6)
CTRL485_4: MainProc (U2.25), UART (U14.2)
CTRL485_5: MainProc (U2.24), UART (U14.3)
GPIO_I1: MainProc (U2.97), GPIO (U4.8)
GPIO_I2: MainProc (U2.98), GPIO (U4.6)
GPIO_I3: MainProc (U2.99), GPIO (U5.8)
GPIO_I4: MainProc (U2.100), GPIO (U5.6)
GPIO_I5: MainProc (U2.103), GPIO (U6.8)
GPIO_I6: MainProc (U2.104), GPIO (U6.6)
GPIO_O1: MainProc (U2.105), GPIO (U7.2)
GPIO_O2: MainProc (U2.106), GPIO (U7.4)
GPIO_O3: MainProc (U2.107), GPIO (U8.2)
GPIO_O4: MainProc (U2.108), GPIO (U8.4)
GPIO_O5: MainProc (U2.109), GPIO (U9.2)
GPIO_O6: MainProc (U2.110), GPIO (U9.4)
IIC_0: MainProc (U2.111), IIC (R29.1 U17.3 U21.6)
IIC_1: MainProc (U2.112), IIC (R28.2 U17.4 U21.5)
IO_AAG_0: GPIO (JP1.1), IIC (Q1.3)
IO_AAG_1: GPIO (JP4.1), IIC (Q2.3)
IO_AAG_2: GPIO (JP2.1), IIC (S3.4 U20.10)
IO_AAG_3: GPIO (JP1.3 JP3.1), IIC (S3.3 U20.12)
SPI_0: MainProc (U2.36), SPI (U15.2 U16.6)
SPI_1: MainProc (U2.34), SPI (U15.8 U16.2)
SPI_2: MainProc (U2.35), SPI (U15.1 U16.5)
SPI_3: MainProc (U2.37), SPI (R38.2 U15.4)
SPI_4: MainProc (U2.38), SPI (R39.2 U16.1)
UART_0: MainProc (U2.31), UART (U12.11 U14.4)
UART_1: MainProc (U2.30), UART (JP6.2 U11.4)
UART_2: MainProc (U2.33), UART (U12.10 U13.4)
UART_3: MainProc (U2.32), UART (JP5.2 U10.4)